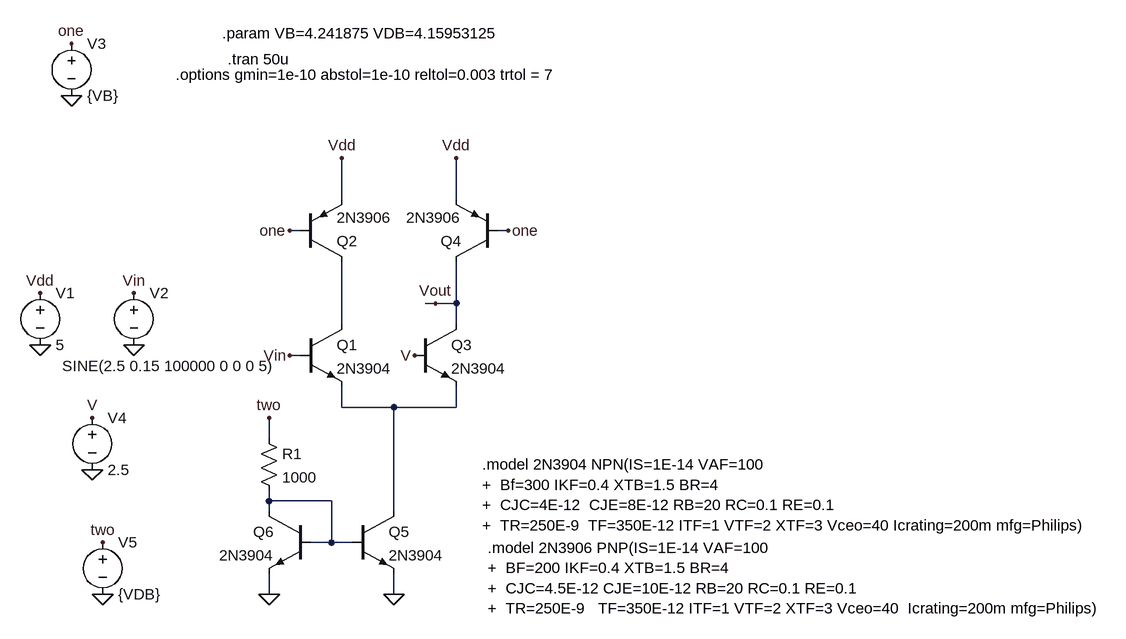
[diagram p0: schematic DiffAmp.asc]
DiffAmp.asc, the LTspice schematic file:
Version 4
SHEET 1 1392 680
WIRE 208 32 208 -32
WIRE 384 32 384 -32
WIRE 144 80 128 80
WIRE 464 80 448 80
WIRE 352 192 336 192
WIRE 384 192 384 128
WIRE 384 192 352 192
WIRE 208 224 208 128
WIRE 384 224 384 192
WIRE 144 272 128 272
WIRE 208 352 208 320
WIRE 288 352 208 352
WIRE 384 352 384 320
WIRE 384 352 288 352
WIRE 96 400 96 368
WIRE 96 496 96 480
WIRE 192 496 96 496
WIRE 96 512 96 496
WIRE 288 512 288 352
WIRE 192 560 192 496
WIRE 192 560 160 560
WIRE 224 560 192 560
WIRE 96 640 96 608
WIRE 288 640 288 608
FLAG 208 -32 Vdd
FLAG 128 80 one
FLAG 128 272 Vin
FLAG -256 176 Vdd
FLAG -112 176 Vin
FLAG -256 256 0
FLAG -112 256 0
FLAG -208 -128 0
FLAG -208 -208 one
FLAG 384 -32 Vdd
FLAG 464 80 one
FLAG 352 192 Vout
FLAG 320 272 V
FLAG -176 368 V
FLAG -176 448 0
FLAG 96 368 two
FLAG 96 640 0
FLAG 288 640 0
FLAG -160 640 0
FLAG -160 560 two
SYMBOL npn 144 224 R0
SYMATTR InstName Q1
SYMATTR Value 2N3904
SYMBOL pnp 144 128 M180
SYMATTR InstName Q2
SYMATTR Value 2N3906
SYMBOL voltage -256 160 R0
WINDOW 123 0 0 Left 2
WINDOW 39 0 0 Left 2
SYMATTR InstName V1
SYMATTR Value 5
SYMBOL voltage -112 160 R0
WINDOW 3 -110 128 Left 2
WINDOW 123 0 0 Left 2
WINDOW 39 0 0 Left 2
SYMATTR Value SINE(2.5 0.15 100000 0 0 0 5)
SYMATTR InstName V2
SYMBOL voltage -208 -224 R0
WINDOW 123 0 0 Left 2
WINDOW 39 0 0 Left 2
SYMATTR InstName V3
SYMATTR Value {VB}
SYMBOL npn 320 224 R0
SYMATTR InstName Q3
SYMATTR Value 2N3904
SYMBOL pnp 448 128 R180
SYMATTR InstName Q4
SYMATTR Value 2N3906
SYMBOL voltage -176 352 R0
WINDOW 123 0 0 Left 2
WINDOW 39 0 0 Left 2
SYMATTR InstName V4
SYMATTR Value 2.5
SYMBOL npn 224 512 R0
SYMATTR InstName Q5
SYMATTR Value 2N3904
SYMBOL npn 160 512 M0
SYMATTR InstName Q6
SYMATTR Value 2N3904
SYMBOL res 80 384 R0
SYMATTR InstName R1
SYMATTR Value 1000
SYMBOL voltage -160 544 R0
WINDOW 123 0 0 Left 2
WINDOW 39 0 0 Left 2
SYMATTR InstName V5
SYMATTR Value {VDB}
TEXT 24 -224 Left 2 !.param VB=4.241875 VDB=4.15953125
TEXT 32 -184 Left 2 !.tran 50u
TEXT -48 -160 Left 2 !.options gmin=1e-10 abstol=1e-10 reltol=0.003 trtol = 7
TEXT 424 440 Left 2 !.model 2N3904 NPN(IS=1E-14 VAF=100\n+  Bf=300 IKF=0.4 XTB=1.5 BR=4\n+  CJC=4E-12  CJE=8E-12 RB=20 RC=0.1 RE=0.1\n+  TR=250E-9  TF=350E-12 ITF=1 VTF=2 XTF=3 Vceo=40 Icrating=200m mfg=Philips)
TEXT 432 568 Left 2 !.model 2N3906 PNP(IS=1E-14 VAF=100\n+  BF=200 IKF=0.4 XTB=1.5 BR=4\n+  CJC=4.5E-12 CJE=10E-12 RB=20 RC=0.1 RE=0.1\n+  TR=250E-9   TF=350E-12 ITF=1 VTF=2 XTF=3 Vceo=40  Icrating=200m mfg=Philips)

The netlist it stands for:
* DiffAmp.asc
Q1 N001 Vin N002 0 2N3904
Q2 N001 one Vdd 0 2N3906
V1 Vdd 0 5
V2 Vin 0 SINE(2.5 0.15 100000 0 0 0 5)
V3 one 0 {VB}
Q3 Vout V N002 0 2N3904
Q4 Vout one Vdd 0 2N3906
V4 V 0 2.5
Q5 N002 N003 0 0 2N3904
Q6 N003 N003 0 0 2N3904
R1 two N003 1000
V5 two 0 {VDB}
.model NPN NPN
.model PNP PNP
.lib standard.bjt
.param VB=4.241875 VDB=4.15953125
.tran 50u
.options gmin=1e-10 abstol=1e-10 reltol=0.003 trtol = 7
.model 2N3904 NPN(IS=1E-14 VAF=100
+  Bf=300 IKF=0.4 XTB=1.5 BR=4
+  CJC=4E-12  CJE=8E-12 RB=20 RC=0.1 RE=0.1
+  TR=250E-9  TF=350E-12 ITF=1 VTF=2 XTF=3 Vceo=40 Icrating=200m mfg=Philips)
.model 2N3906 PNP(IS=1E-14 VAF=100
+  BF=200 IKF=0.4 XTB=1.5 BR=4
+  CJC=4.5E-12 CJE=10E-12 RB=20 RC=0.1 RE=0.1
+  TR=250E-9   TF=350E-12 ITF=1 VTF=2 XTF=3 Vceo=40  Icrating=200m mfg=Philips)
.backanno
.end